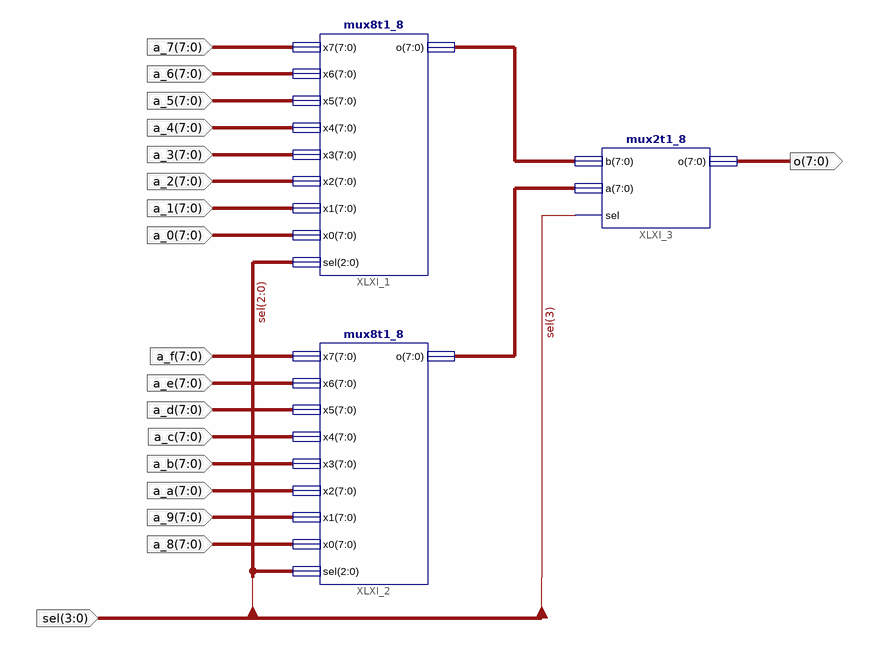
[diagram p0: schematic sheet 1]
// Xilinx ISE schematic mux16t1_8.sch (kintex7) as structural Verilog: 3 symbols, 18 ports
module mux16t1_8 (
  input  [7:0] a_7,
  input  [7:0] a_6,
  input  [7:0] a_5,
  input  [7:0] a_4,
  input  [7:0] a_3,
  input  [7:0] a_2,
  input  [7:0] a_1,
  input  [7:0] a_0,
  input  [7:0] a_f,
  input  [7:0] a_e,
  input  [7:0] a_d,
  input  [7:0] a_c,
  input  [7:0] a_b,
  input  [7:0] a_a,
  input  [7:0] a_9,
  input  [7:0] a_8,
  input  [3:0] sel,
  output [7:0] o
);

  wire [7:0] XLXN_1, XLXN_2;

  mux8t1_8 XLXI_1 (
    .x7(a_7), .x6(a_6), .x5(a_5), .x4(a_4), .x3(a_3), .x2(a_2), .x1(a_1), .x0(a_0), .sel(sel[2:0]), .o(XLXN_1));
  mux8t1_8 XLXI_2 (
    .x7(a_f), .x6(a_e), .x5(a_d), .x4(a_c), .x3(a_b), .x2(a_a), .x1(a_9), .x0(a_8), .sel(sel[2:0]), .o(XLXN_2));
  mux2t1_8 XLXI_3 (.b(XLXN_1), .a(XLXN_2), .sel(sel[3]), .o(o));
endmodule
